# EasyEDA schematic dev_board_template_1.json
TITLE: Sheet_1; REV: 1.0; Date: 2024-12-18; Sheet: 1/1; Drawn By: adideb-das; Company: NOTYCircuits
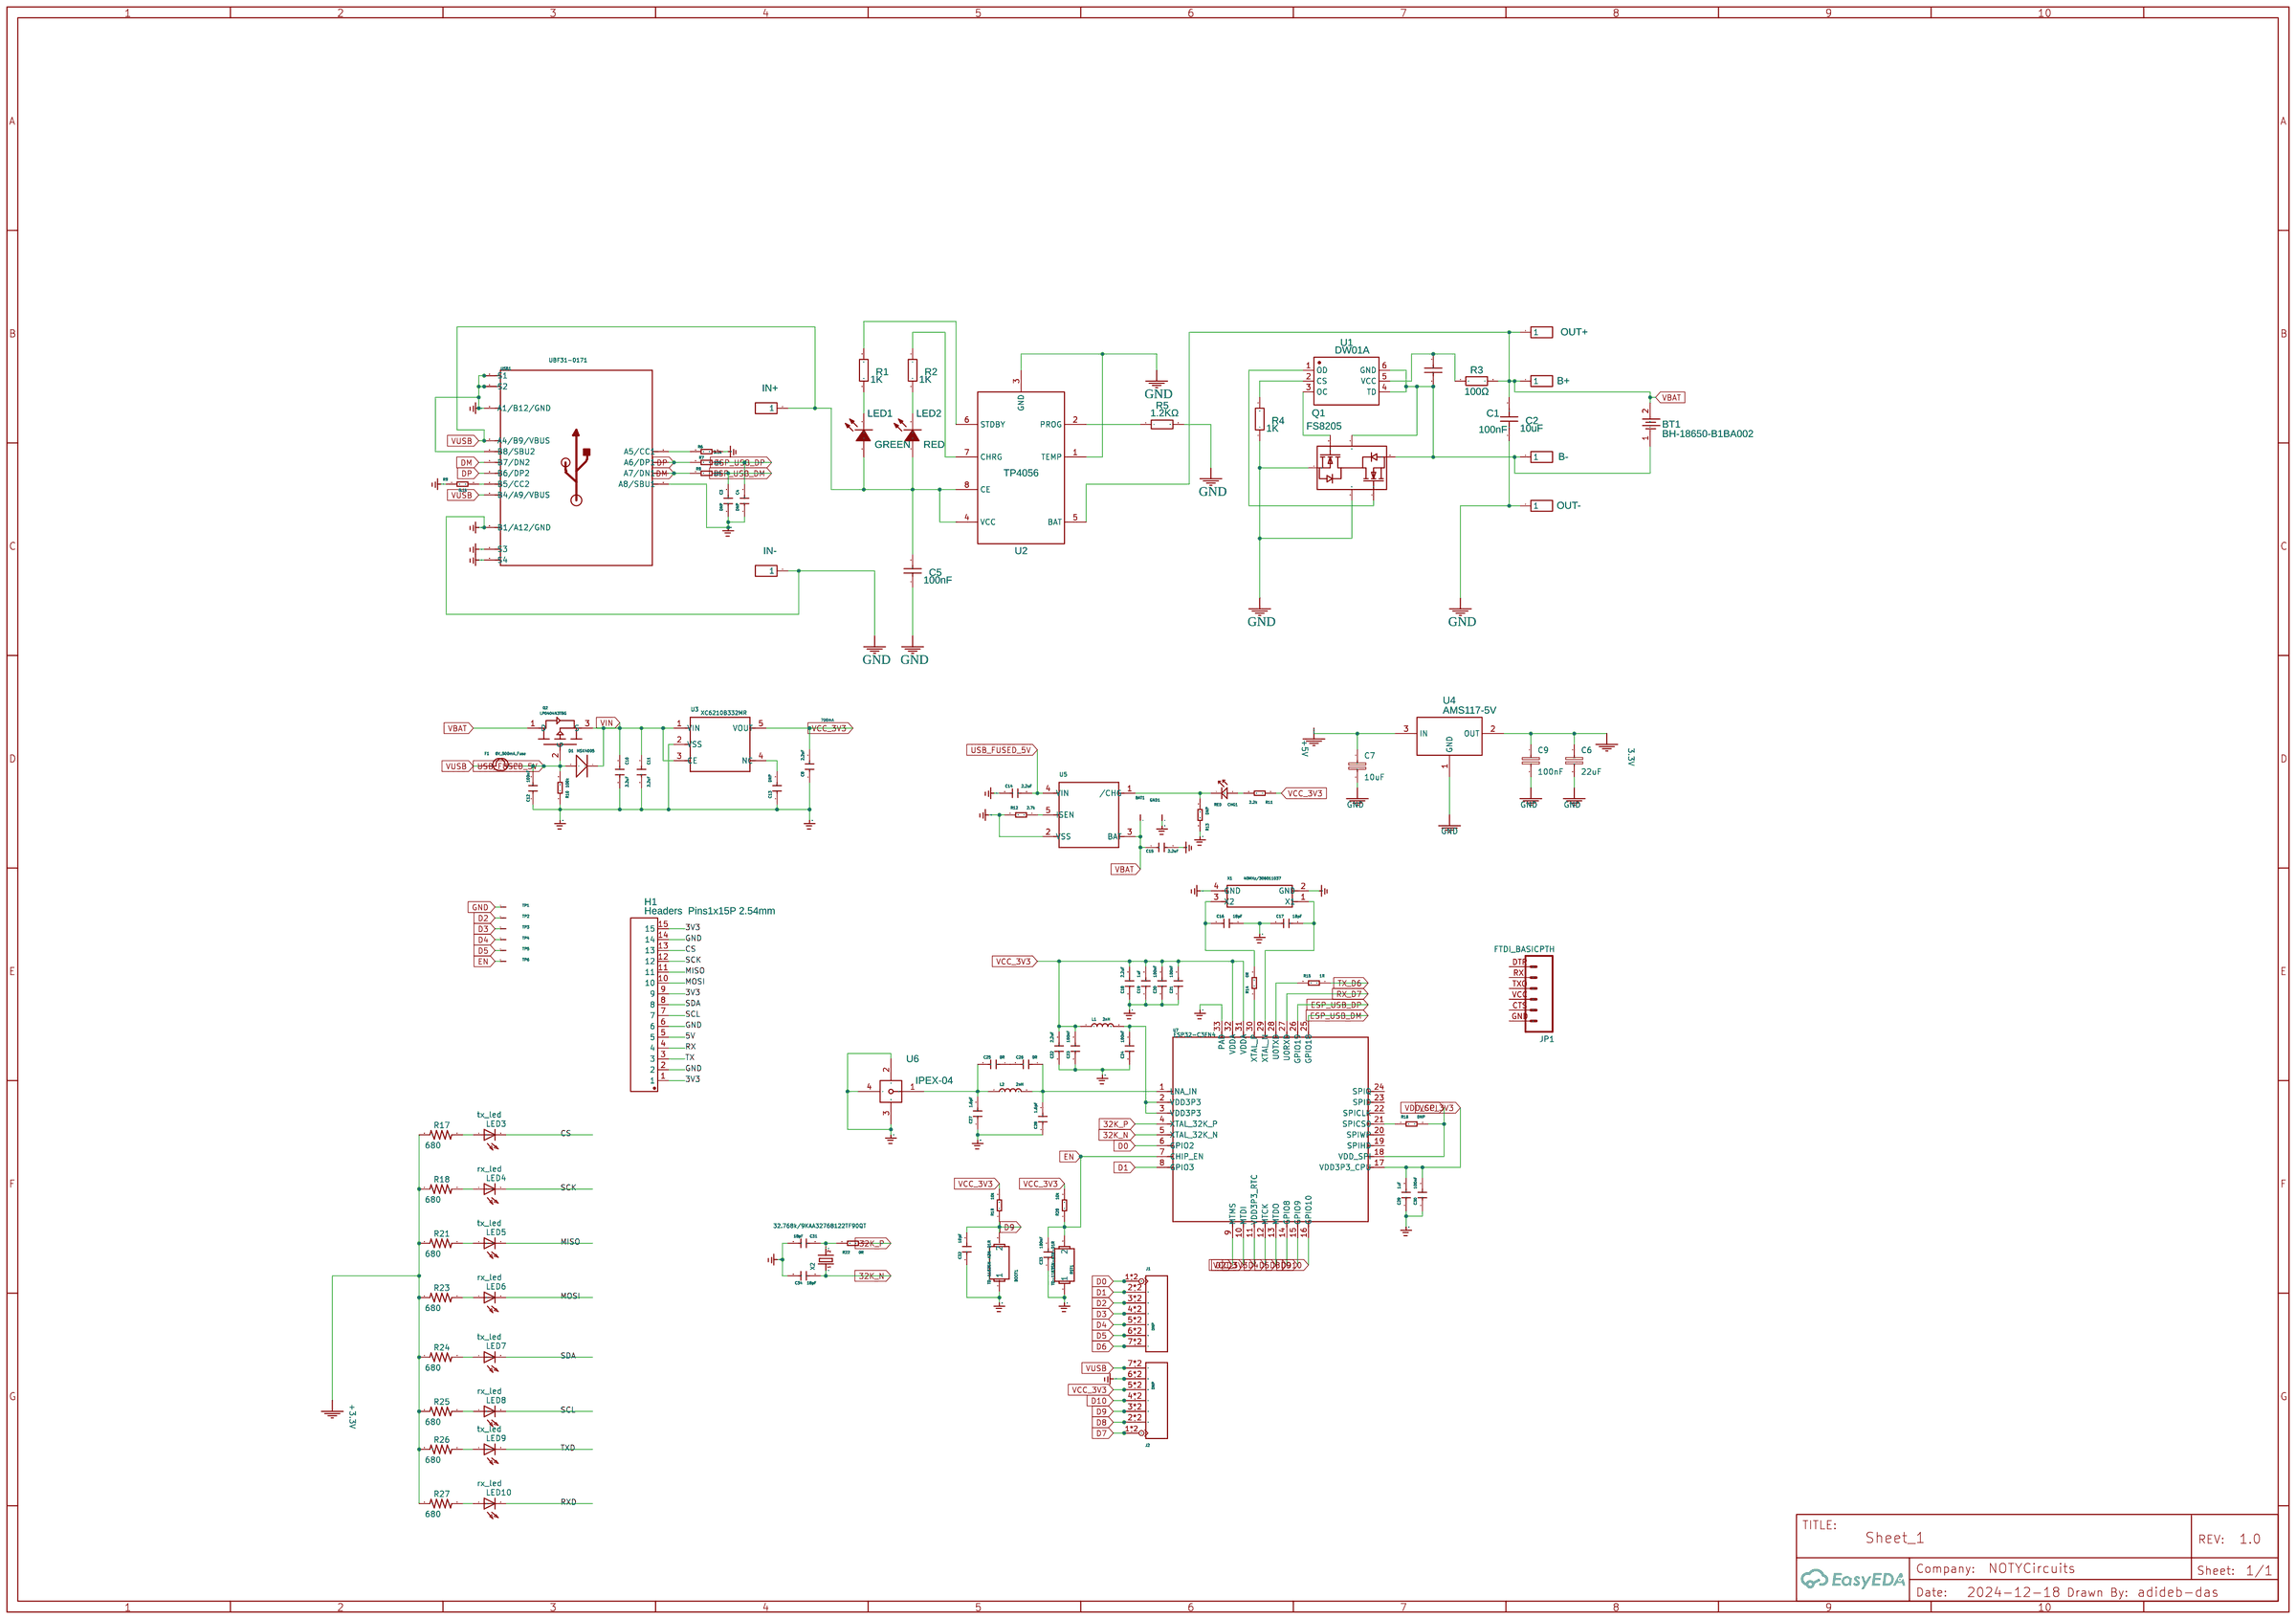
[diagram p0: schematic sheet]

## Parts
B+  Header-Male-2.54_1x1  [HDR-1X1/2.54]
B-  Header-Male-2.54_1x1  [HDR-1X1/2.54]
BAT1  DNP  [TP-80X40MIL]
BOOT1  TD-1183SN-A3N-D1R  [BUTTON_TD1183SA]
BT1  BH-18650-B1BA002  [BATTERY-SMD_18650-1S-L77.1-W20.7-1]
C1  100nF  [0603]
C2  10uF  [0603]
C3  DNP  [C0201]
C4  DNP  [C0201]
C5  100nF  [0603]
C6  22uF  [C3216]
C7  10uF  [C3216]
C8  2.2uF  [C0201]
C9  100nF  [0603-CAP]
C10  2.2uF  [C0201]
C11  2.2uF  [C0201]
C12  100nF  [C0201]
C13  DNP  [C0201]
C14  2.2uF  [C0201]
C15  2.2uF  [C0201]
C16  18pF  [C0201]
C17  18pF  [C0201]
C18  2.2uF  [C0201]
C19  1uF  [C0201]
C20  100nF  [C0201]
C21  100nF  [C0201]
C22  2.2uF  [C0201]
C23  100nF  [C0201]
C24  100nF  [C0201]
C25  0R  [C0201]
C26  0R  [C0201]
C27  1.6pF  [C0201]
C28  1.6pF  [C0201]
C29  1uF  [C0201]
C30  100nF  [C0201]
C31  18pF  [C0201]
C32  10pF  [C0201]
C33  100nF  [C0201]
C34  18pF  [C0201]
CHG1  RED  [LED-0402]
D1  MSK4005  [SOD-523]
F1  6V_500mA_Fuse  [F0603]
G1  GND_POWER
G2  GND_POWER
G3  GND_POWER
G4  GND_POWER
G5  GND_POWER
G6  GND_POWER
G7  GND_POWER
G8  GND_POWER
G9  GND_POWER
G10  GND_POWER
G11  GND_POWER
G12  GND_POWER
G13  GND_POWER
G14  GND_POWER
G15  GND_POWER
G16  GND_POWER
G17  GND_POWER
G18  GND_POWER
G19  GND_POWER
G20  GND_POWER
G21  GND_POWER
G22  GND_POWER
G23  GND_POWER
G24  GND_POWER
G25  GND_POWER
G26  GND_POWER
G27  GND_POWER
GND1  DNP  [TP-80X40MIL]
H1  Headers  Pins1x15P 2.54mm  [HDR-TH_15P-P2.54-V-M]
IN+  Header-Male-2.54_1x1  [HDR-1X1/2.54]
IN-  Header-Male-2.54_1x1  [HDR-1X1/2.54]
J1  DNP  [H7-HALF-HOLE-2.54]
J2  DNP  [H7-HALF-HOLE-2.54]
JP1  FTDI_BASICPTH  [FTDI_BASIC]
L1  2nH  [L0201]
L2  2nH  [L0201]
LED1  GREEN  [LED-0603]
LED2  RED  [LED-0603]
LED3  tx_led  [CHIP-LED0805]
LED4  rx_led  [CHIP-LED0805]
LED5  tx_led  [CHIP-LED0805]
LED6  rx_led  [CHIP-LED0805]
LED7  tx_led  [CHIP-LED0805]
LED8  rx_led  [CHIP-LED0805]
LED9  tx_led  [CHIP-LED0805]
LED10  rx_led  [CHIP-LED0805]
OUT+  Header-Male-2.54_1x1  [HDR-1X1/2.54]
OUT-  Header-Male-2.54_1x1  [HDR-1X1/2.54]
Q1  FS8205  [SOT-23-6]
Q2  LP0404N3T5G  [PMOS_1.0*0.6*0.35MM]
R1  1K  [0603]
R2  1K  [0603]
R3  100Ω  [0603]
R4  1K  [0603]
R5  1.2KΩ  [0603]
R6  5.1k  [R0201]
R7  22R  [R0201]
R8  22R  [R0201]
R9  5.1k  [R0201]
R10  100k  [R0201]
R11  2.2k  [R0201]
R12  2.7k  [R0201]
R13  DNP  [R0201]
R14  0R  [R0201]
R15  1R  [R0201]
R16  DNP  [R0201]
R17  680  [0603-RES]
R18  680  [0603-RES]
R19  10k  [R0201]
R20  10k  [R0201]
R21  680  [0603-RES]
R22  0R  [R0201]
R23  680  [0603-RES]
R24  680  [0603-RES]
R25  680  [0603-RES]
R26  680  [0603-RES]
R27  680  [0603-RES]
RST1  TD-1183SN-A3N-D1R  [BUTTON_TD1183SA]
TP1  DNP  [TP-D45MIL]
TP2  DNP  [TP-D45MIL]
TP3  DNP  [TP-D45MIL]
TP4  DNP  [TP-D45MIL]
TP5  DNP  [TP-D45MIL]
TP6  DNP  [TP-D45MIL]
U1  DW01A  [SOT-23-6L]
U2  TP4056  [SOP-8_EP_150MIL]
U3  XC6210B332MR  [SOT-25]
U4  AMS117-5V  [AMS117-TOPL]
U5  PMIC-XC6802MR  [SOT-25]
U6  IPEX-04  [IPEX-SMD_IPEX-04]
U7  ESP32-C3FN4  [QFN32G-0.5-5X5MM]
USB1  UBF31-0171  [USB2.0-TYPE-C]
X1  40MHz/306011037  [X4-SMD-2.0X1.6X0.5MM]
X2  32.768k/9KAA32768122TF90QT  [X2-SMD-1.6X1.0X0.5MM]

## Library data of the parts
B+ B- IN+ IN- OUT+ OUT- = -: Supplier Part: C81276; Supplier: LCSC; Manufacturer: ReliaPro
BT1 = BH-18650-B1BA002: Contributor: lcsc; Supplier: LCSC; Supplier Part: C2988620; Manufacturer: MYOUNG(美阳); JLCPCB Part Class: Extended Part
C1 C5 = 0603B104K250: Supplier: LCSC; Manufacturer: WTC; Supplier Part: C83054
C2 = CL10A106MP8NNNC: Supplier: LCSC; Manufacturer: SAMSUNG; Supplier Part: C85713
H1 = Headers  Pins1x15P 2.54mm: Supplier Part: C54102; Supplier: LCSC; Manufacturer: null; Manufacturer Part: 排针1x15P 2.54mm; JLCPCB Part Class: Extended Part
LED1 = -: Supplier: LCSC; Manufacturer: LITEON; Manufacturer Part: LTST-C193TGKT-5A; Supplier Part: C12065
LED2 = -: Supplier: LCSC; Manufacturer: LITEON; Manufacturer Part: LTST-C191KRKT; Contributor: LCSC; Supplier Part: C125099
Q1 = -: Supplier: LCSC; Manufacturer: FORTUNE; LCSC Assembly: Yes; image: //image.lceda.cn/szlcsc/C32254.jpg; Supplier Part: C32254
R1 R2 R4 = ERJ3GEYJ102V: Supplier: LCSC; Manufacturer: PANASONIC; Contributor: LCSC; Supplier Part: C180848
R3 = 0603WAJ0101T5E: Supplier: LCSC; Manufacturer: UniOhm; Supplier Part: C25201
R5 = RC0603JR-071K2L: Supplier: LCSC; Manufacturer: YAGEO; Supplier Part: C114679
U1 = -: Supplier: LCSC; Manufacturer: PUOLOP; Contributor: LCSC; Supplier Part: C351410
U2 = -: Contributor: Guest; Supplier: LCSC; Manufacturer: TOPPOWER; LCSC Assembly: Yes; image: //image.lceda.cn/szlcsc/C16581.jpg; Supplier Part: C16581
U4 = AMS117: Contributor: Achmad Purnomo
U6 = IPEX-04: Supplier: LCSC; Supplier Part: C36936660; Manufacturer: BXCONN(宝讯); Contributor: lcsc

## Nets
3.3V: C6.1 C9.1 U4.2(OUT)
3V3: H1.1 H1.9 H1.15
5V: H1.5
+3.3V: R17.1 R18.1 R21.1 R23.1 R24.1 R25.1 R26.1 R27.1
+5V: C7.1 U4.3(IN)
GND: C2.1 C5.1 C6.2 C7.2 C9.2 G4.(GND) H1.2 H1.6 H1.14 IN-.1 OUT-.1 Q1.1(S1) Q1.5(D12) R4.1 R5.2 TP1.T U2.1(TEMP) U2.3(GND) U4.1(GND) USB1.B1_A12(B1/A12/GND)
VBAT: B+.1 BAT1.1(T) BT1.2 C2.2 C15.1 OUT+.1 Q2.1(D) R3.2 U2.5(BAT) U5.3(BAT)
VCC_3V3: C8.2 C18.2 C19.2 C20.2 C21.2 C22.2 C23.2 C29.2 C30.2 J2.5*2(5) J2.17(5) L1.1 R11.1 R19.2 R20.2 U3.5(VOUT) U7.11(VDD3P3_RTC) U7.17(VDD3P3_CPU) U7.31(VDDA) U7.32(VDDA)
VDD_SPI: R16.2 U7.18(VDD_SPI)
VIN: C10.1 C11.1 D1.- Q2.3(S) U3.1(VIN) U3.3(CE)
32K_N: C34.1 U7.5(XTAL_32K_N) X2.1
32K_P: R22.1 U7.4(XTAL_32K_P)
CS: H1.13 LED3.C
D0: J1.1*2(1) J1.13(1) U7.6(GPIO2)
D1: J1.2*2(2) J1.14(2) U7.8(GPIO3)
D2: J1.3*2(3) J1.15(3) TP2.T U7.9(MTMS)
D3: J1.4*2(4) J1.16(4) TP3.T U7.10(MTDI)
D4: J1.5*2(5) J1.17(5) TP4.T U7.12(MTCK)
D5: J1.6*2(6) J1.18(6) TP5.T U7.13(MTDO)
D6: J1.7*2(7) J1.19(7)
D7: J2.1*2(1) J2.13(1)
D8: J2.2*2(2) J2.14(2) U7.14(GPIO8)
D9: BOOT1.2 C32.2 J2.3*2(3) J2.15(3) R19.1 U7.15(GPIO9)
D10: J2.4*2(4) J2.16(4) U7.16(GPIO10)
DM: R8.1 USB1.A7(A7/DN1) USB1.B7(B7/DN2)
DP: R7.1 USB1.A6(A6/DP1) USB1.B6(B6/DP2)
EN: C33.2 R20.1 RST1.2 TP6.T U7.7(CHIP_EN)
ESP_USB_DM: C3.2 R8.2 U7.25(GPIO18)
ESP_USB_DP: C4.2 R7.2 U7.26(GPIO19)
MISO: H1.11 LED5.C
MOSI: H1.10 LED6.C
RX: H1.4
RX_D7: U7.27(U0RXD)
RXD: LED10.C
SCK: H1.12 LED4.C
SCL: H1.7 LED8.C
SDA: H1.8 LED7.C
TX: H1.3
TX_D6: R15.1
TXD: LED9.C
USB_FUSED_5V: C12.2 C14.2 D1.+ F1.2 Q2.2(G) R10.2 U5.4(VIN)
VUSB: C5.2 F1.1 IN+.1 J2.7*2(7) J2.19(7) LED1.1(A) LED2.1(A) U2.4(VCC) U2.8(CE) USB1.A4_B9(A4/B9/VBUS) USB1.B4_A9(B4/A9/VBUS)
Net-(B--1): B-.1 BT1.1 C1.2 Q1.2(D12) Q1.3(S2) U1.4(TD) U1.6(GND)
Net-(BOOT1-1): BOOT1.1 C32.1 G25.(GND)
Net-(C1-1): C1.1 R3.1 U1.5(VCC)
Net-(C3-1): C3.1 C4.1 G5.(GND) USB1.A8(A8/SBU1)
Net-(C8-1): C8.1 C10.2 C11.2 C12.1 C13.1 G10.(GND) G11.(GND) R10.1 U3.2(VSS)
Net-(C13-2): C13.2 U3.4(NC)
Net-(C14-1): C14.1 G8.(GND)
Net-(C15-2): C15.2 G14.(GND)
Net-(C16-1): C16.1 R14.2 X1.3(X2)
Net-(C16-2): C16.2 C17.2 G17.(GND)
Net-(C17-1): C17.1 U7.29(XTAL_N) X1.1(X1)
Net-(C18-1): C18.1 C19.1 C20.1 C21.1 G18.(GND)
Net-(C22-1): C22.1 C23.1 C24.1 G20.(GND)
Net-(C24-2): C24.2 L1.2 U7.2(VDD3P3) U7.3(VDD3P3)
Net-(C25-1): C25.1 C26.2
Net-(C25-2): C25.2 C27.2 L2.1 U6.1
Net-(C26-1): C26.1 C28.2 L2.2 U7.1(LNA_IN)
Net-(C27-1): C27.1 C28.1 G22.(GND)
Net-(C29-1): C29.1 C30.1 G23.(GND)
Net-(C31-1): C31.1 R22.2 X2.2
Net-(C31-2): C31.2 C34.2 G24.(GND)
Net-(C33-1): C33.1 G26.(GND) RST1.1
Net-(CHG1-+): CHG1.+ R11.2
Net-(CHG1--): CHG1.- R13.1 U5.1(/CHG)
Net-(G1-): G1.(GND) USB1.A1_B12(A1/B12/GND) USB1.B8(B8/SBU2) USB1.S1 USB1.S2 USB1.S5(S1) USB1.S6(S2)
Net-(G2-): G2.(GND) R6.2
Net-(G3-): G3.(GND) R9.1
Net-(G6-): G6.(GND) USB1.S3
Net-(G7-): G7.(GND) USB1.S4
Net-(G9-): G9.(GND) R12.2 U5.2(VSS)
Net-(G12-): G12.(GND) GND1.1(T)
Net-(G13-): G13.(GND) R13.2
Net-(G15-): G15.(GND) X1.4(GND)
Net-(G16-): G16.(GND) X1.2(GND)
Net-(G19-): G19.(GND) U7.33(PAD)
Net-(G21-): G21.(GND) U6.2 U6.3 U6.4
Net-(G27-): G27.(GND) J2.6*2(6) J2.18(6)
Net-(LED1-2): LED1.2(K) R1.1
Net-(LED2-2): LED2.2(K) R2.2
Net-(LED3-A): LED3.A R17.2
Net-(LED4-A): LED4.A R18.2
Net-(LED5-A): LED5.A R21.2
Net-(LED6-A): LED6.A R23.2
Net-(LED7-A): LED7.A R24.2
Net-(LED8-A): LED8.A R25.2
Net-(LED9-A): LED9.A R26.2
Net-(LED10-A): LED10.A R27.2
Net-(Q1-4): Q1.4(G2) U1.1(OD)
Net-(Q1-6): Q1.6(G1) U1.3(OC)
Net-(R1-2): R1.2 U2.6(STDBY)
Net-(R2-1): R2.1 U2.7(CHRG)
Net-(R4-2): R4.2 U1.2(CS)
Net-(R5-1): R5.1 U2.2(PROG)
Net-(R6-1): R6.1 USB1.A5(A5/CC1)
Net-(R9-2): R9.2 USB1.B5(B5/CC2)
Net-(R12-1): R12.1 U5.5(ISEN)
Net-(R14-1): R14.1 U7.30(XTAL_P)
Net-(R15-2): R15.2 U7.28(U0TXD)
Net-(R16-1): R16.1 U7.21(SPICS0)

Not connected (* = marked no-connect by the designer): JP1 CTS(5) DTR(1) GND(6) RXI(2) TXO(3) VCC(4); U7 19(SPIHD) 20(SPIWP) 22(SPICLK) 23(SPID) 24(SPIQ)

## Notes on the sheet
- 700mA
